# Altium project Lab7-8.PrjPcb
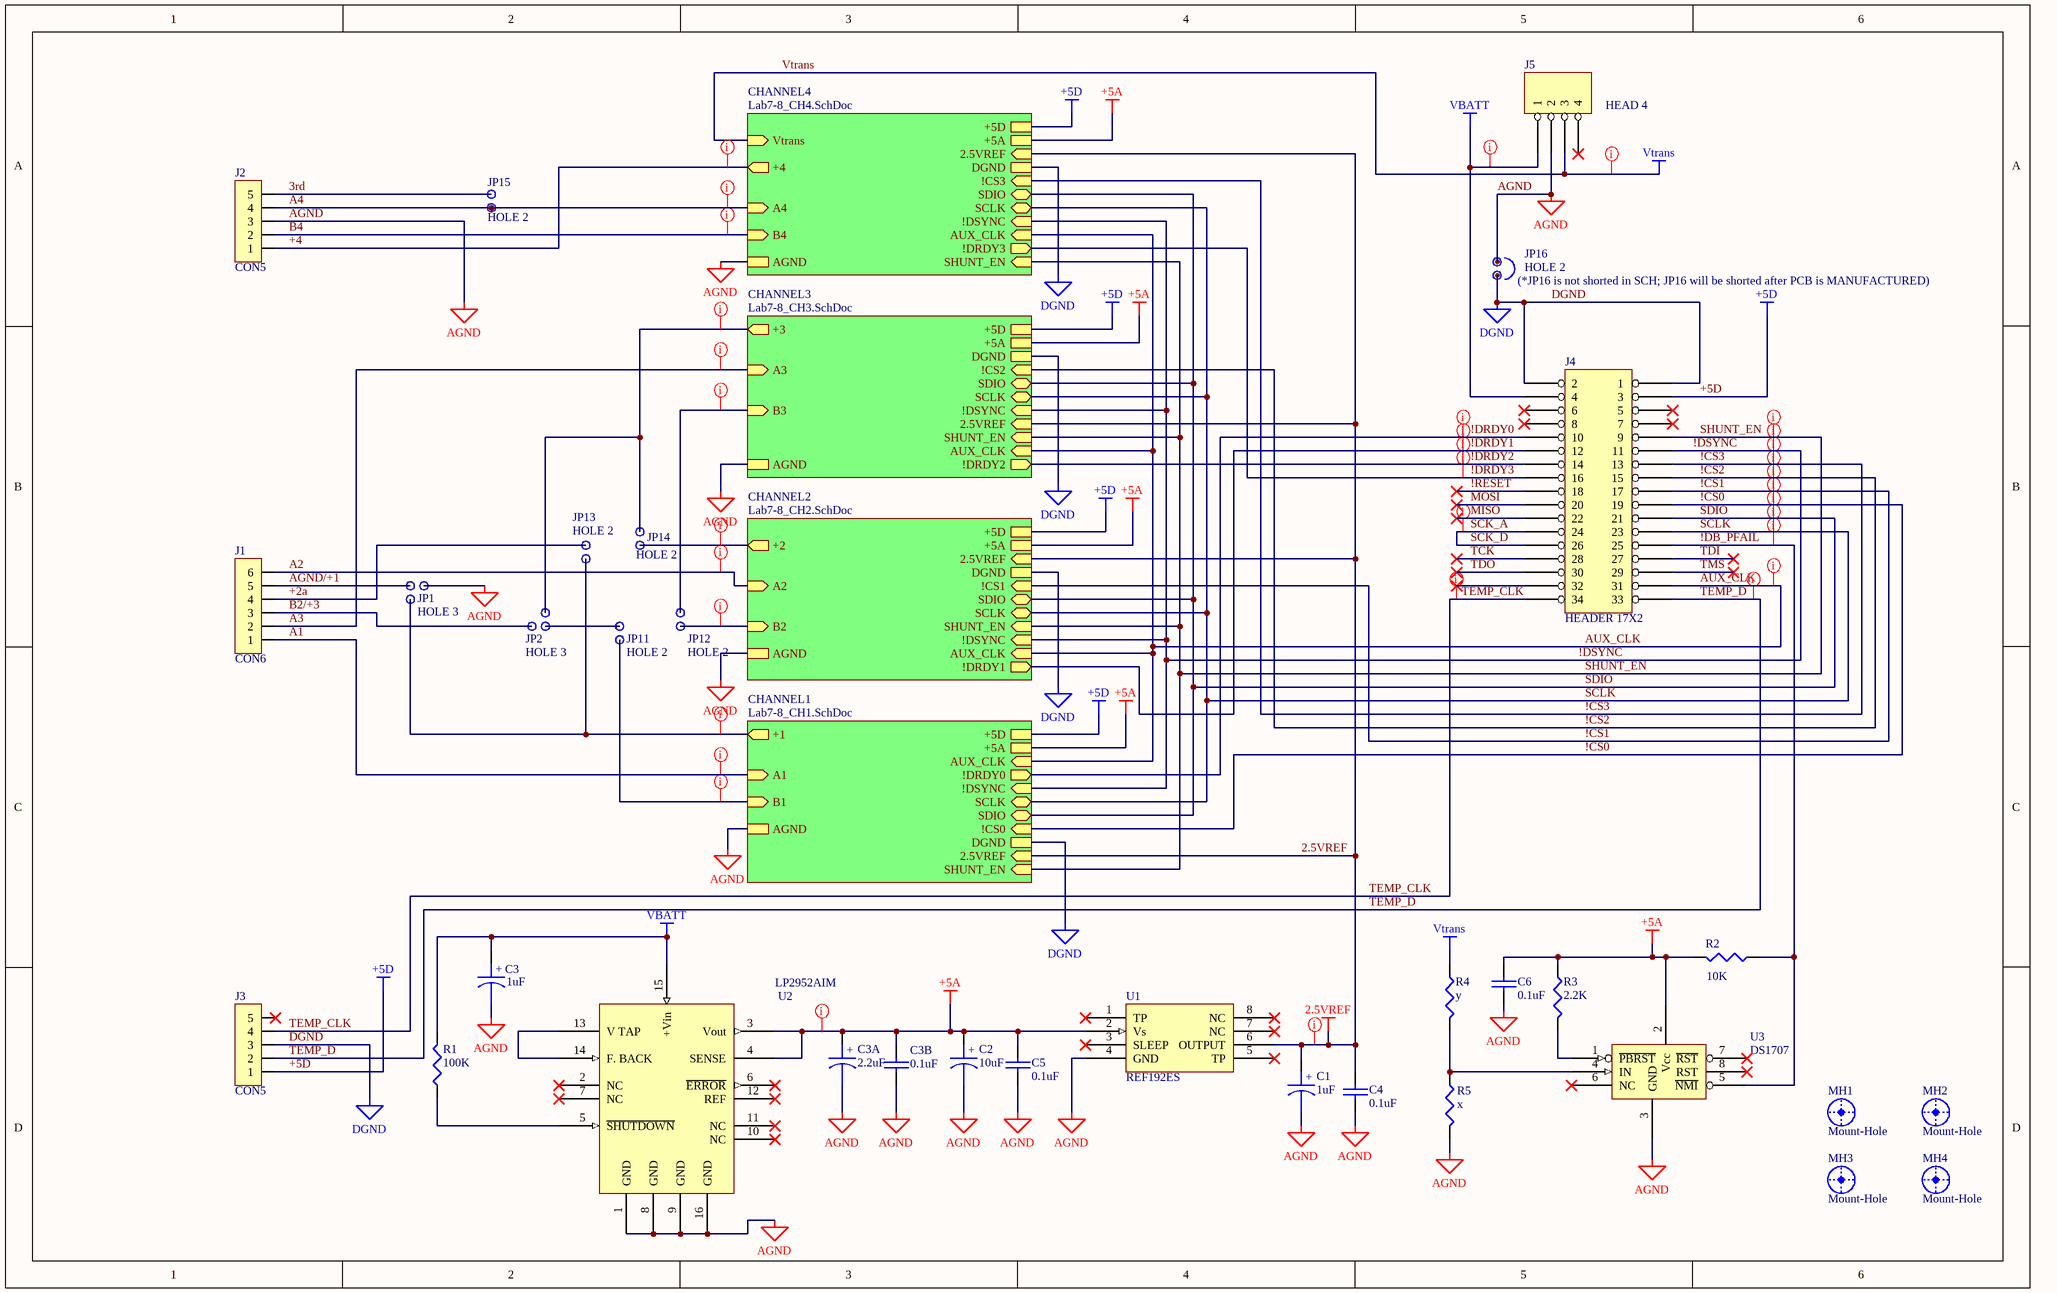
[diagram p0: Lab7-8_TOP.SchDoc]
5 sheets, 121 parts. Net scope: hierarchical (ports join the sheet entries above them; power ports are global).
Board file: Lab9-10.PcbDoc
Sheets:
  Lab7-8_TOP.SchDoc
    CHANNEL1 = Lab7-8_CH1.SchDoc
    CHANNEL2 = Lab7-8_CH2.SchDoc
    CHANNEL3 = Lab7-8_CH3.SchDoc
    CHANNEL4 = Lab7-8_CH4.SchDoc

## Sheet Lab7-8_TOP.SchDoc
size B; DrawnBy: Aaron Huinink; SheetNumber: 1; SheetTotal: 5

### Parts
C1  1uF  [3528]
C2  10uF  [3528]
C3  1uF  [3528]
C3A  2.2uF  [3528]
C3B  0.1uF  [0805]
C4  0.1uF  [0805]
C5  0.1uF  [0805]
C6  0.1uF  [0805]
J1  CON6  [FSFD4.6]
J2  CON5  [FSFD4.5]
J3  CON5  [FSFD4.5]
J4  HEADER 17X2  [HDR2X17]
J5  HEAD 4  [70543-4A]
JP1  HOLE 3  [RAD0.1A]
JP2  HOLE 3  [RAD0.1A]
JP11  HOLE 2  [RAD0.1]
JP12  HOLE 2  [RAD0.1]
JP13  HOLE 2  [RAD0.1]
JP14  HOLE 2  [RAD0.1]
JP15  HOLE 2  [RAD0.1]
JP16  HOLE 2  [RAD0.1]
MH1  Mount-Hole  [screw 4-40]
MH2  Mount-Hole  [screw 4-40]
MH3  Mount-Hole  [screw 4-40]
MH4  Mount-Hole  [screw 4-40]
R1  100K  [0805]
R2  10K  [0805]
R3  2.2K  [0805]
R4  y  [0805]
R5  x  [0805]
U1  REF192ES  [SO-8]
U2  LP2952AIM  [SO-16]
U3  DS1707  [SO-8]

### Sub-sheets
CHANNEL1 = Lab7-8_CH1.SchDoc: +1 (out), A1 (in), B1 (in), AGND, AUX_CLK (in), +5A, +5D, !DSYNC (in), SCLK (bidir), SDIO (bidir), !DRDY0 (out), !CS0 (in), DGND, 2.5VREF (in), SHUNT_EN (in)
CHANNEL2 = Lab7-8_CH2.SchDoc: +2 (out), A2 (in), B2 (in), AGND, AUX_CLK (in), +5A, +5D, SCLK (bidir), SDIO (bidir), !DRDY1 (out), !CS1 (in), DGND, 2.5VREF (in), SHUNT_EN (in), !DSYNC (in)
CHANNEL3 = Lab7-8_CH3.SchDoc: AGND, AUX_CLK (in), +5A, +5D, !DSYNC (in), SCLK (bidir), SDIO (bidir), !DRDY2 (out), !CS2 (in), DGND, 2.5VREF (in), SHUNT_EN (in), +3 (out), A3 (in), B3 (in)
CHANNEL4 = Lab7-8_CH4.SchDoc: AGND, AUX_CLK (in), +5A, +5D, !DSYNC (in), SCLK (bidir), SDIO (bidir), !DRDY3 (out), !CS3 (in), DGND, 2.5VREF (in), SHUNT_EN (in), Vtrans (in), +4 (out), A4 (in), B4 (in)

### Nets
2.5VREF: C1.1 C4.1 U1.6(OUTPUT) ; sheet CHANNEL1/2.5VREF, sheet CHANNEL2/2.5VREF, sheet CHANNEL3/2.5VREF, sheet CHANNEL4/2.5VREF
+5A: C2.1 C3A.1 C3B.1 C5.1 C6.1 R2.2 R3.1 U1.2(Vs) U2.3(Vout) U2.4(SENSE) U3.2(Vcc) ; sheet CHANNEL1/+5A, sheet CHANNEL2/+5A, sheet CHANNEL3/+5A, sheet CHANNEL4/+5A
+5D: J3.1 J4.3 ; sheet CHANNEL1/+5D, sheet CHANNEL2/+5D, sheet CHANNEL3/+5D, sheet CHANNEL4/+5D
AGND: C1.2 C2.2 C3.2 C3A.2 C3B.2 C4.2 C5.2 C6.2 J2.3 J5.2 JP1.3 JP16.2 R5.2 U1.4(GND) U2.1(GND) U2.8(GND) U2.9(GND) U2.16(GND) U3.3(GND) ; sheet CHANNEL1/AGND, sheet CHANNEL2/AGND, sheet CHANNEL3/AGND, sheet CHANNEL4/AGND
DGND: J3.3 J4.1 J4.2 JP16.1 ; sheet CHANNEL1/DGND, sheet CHANNEL2/DGND, sheet CHANNEL3/DGND, sheet CHANNEL4/DGND
VBATT: C3.1 J4.4 J5.1 R1.2 U2.15(+Vin)
Vtrans: J5.3 R4.1 ; sheet CHANNEL4/Vtrans
3rd: J2.5 JP15.2
!CS0: J4.19 ; sheet CHANNEL1/!CS0
!CS1: J4.17 ; sheet CHANNEL2/!CS1
!CS2: J4.15 ; sheet CHANNEL3/!CS2
!CS3: J4.13 ; sheet CHANNEL4/!CS3
!DB_PFAIL: J4.25 R2.1 U3.5(~{NMI})
!DRDY0: J4.10 ; sheet CHANNEL1/!DRDY0
!DRDY1: J4.12 ; sheet CHANNEL2/!DRDY1
!DRDY2: J4.14 ; sheet CHANNEL3/!DRDY2
!DRDY3: J4.16 ; sheet CHANNEL4/!DRDY3
!DSYNC: J4.11 ; sheet CHANNEL1/!DSYNC, sheet CHANNEL2/!DSYNC, sheet CHANNEL3/!DSYNC, sheet CHANNEL4/!DSYNC
!RESET: J4.18
+2a: J1.4 JP13.2
+4: J2.1 ; sheet CHANNEL4/+4
A1: J1.1 ; sheet CHANNEL1/A1
A2: J1.6 ; sheet CHANNEL2/A2
A3: J1.2 ; sheet CHANNEL3/A3
A4: J2.4 JP15.1 ; sheet CHANNEL4/A4
AGND/+1: J1.5 JP1.2
AUX_CLK: J4.31 ; sheet CHANNEL1/AUX_CLK, sheet CHANNEL2/AUX_CLK, sheet CHANNEL3/AUX_CLK, sheet CHANNEL4/AUX_CLK
B2/+3: J1.3 JP2.3
B4: J2.2 ; sheet CHANNEL4/B4
MISO: J4.22
MOSI: J4.20
SCK_A: J4.24 J4.26  [also labelled SCK_D]
SCLK: J4.23 ; sheet CHANNEL1/SCLK, sheet CHANNEL2/SCLK, sheet CHANNEL3/SCLK, sheet CHANNEL4/SCLK
SDIO: J4.21 ; sheet CHANNEL1/SDIO, sheet CHANNEL2/SDIO, sheet CHANNEL3/SDIO, sheet CHANNEL4/SDIO
SHUNT_EN: J4.9 ; sheet CHANNEL1/SHUNT_EN, sheet CHANNEL2/SHUNT_EN, sheet CHANNEL3/SHUNT_EN, sheet CHANNEL4/SHUNT_EN
TCK: J4.28
TDI: J4.27
TDO: J4.30
TEMP_CLK: J3.4 J4.34
TEMP_D: J3.2 J4.33
TMS: J4.29
NetC11_1: JP11.1 ; sheet CHANNEL1/B1
NetC18_1: JP12.1 ; sheet CHANNEL2/B2
NetC24_1: JP12.2 ; sheet CHANNEL3/B3
NetJP1_1: JP1.1 JP13.1 ; sheet CHANNEL1/+1
NetJP2_1: JP2.1 JP14.2 ; sheet CHANNEL3/+3
NetJP2_2: JP2.2 JP11.2
NetJP6_2: JP14.1 ; sheet CHANNEL2/+2
NetR1_1: R1.1 U2.5(~{SHUTDOWN})
NetR3_2: R3.2 U3.1(~{PBRST})
NetR4_2: R4.2 R5.1 U3.4(IN)
NetU2_13: U2.13(V_TAP) U2.14(F._BACK)

Not connected (* = marked no-connect by the designer): J3 5*; J4 5* 6* 7* 8* 32*; J5 4*; U1 1(TP)* 3(SLEEP)* 5(TP)* 7(NC)* 8(NC)*; U2 2(NC)* 6(~{ERROR})* 7(NC)* 10(NC)* 11(NC)* 12(REF)*; U3 6(NC)* 7(~{RST})* 8(RST)*

### Layout directives
net class Digital: !CS0, !CS1, !CS2, !CS3, !DB_PFAIL, !DRDY0, !DRDY1, !DRDY2, !DRDY3, !DSYNC, AUX_CLK, SCK_A, SCLK, SDIO, SHUNT_EN, TEMP_CLK, TEMP_D
net class Power: +4, +5A, NetJP1_1, NetJP2_1, NetJP6_2, VBATT, Vtrans
net class 2.5V_REF: 2.5VREF
net class Analog: A1, A2, A3, A4, B4, NetC11_1, NetC18_1, NetC24_1

### Notes on the sheet
- (near JP16) (*JP16 is not shorted in SCH; JP16 will be shorted after PCB is MANUFACTURED)
- Title
- Size:
- Date:
- A
- Number:
- Time:
- Revision:
- Sheet
- of
- File:
- (in symbol CAPACITOR POL) +

### Library data of the parts
C1-C3 C3A = CAPACITOR POL: Part Field 1: TANT
C3B C4-C6 = CAP
J4 = HEADER 2X17
J5 = HEADER 4
MH1-MH4 = MountHole: Mount hole; LatestRevisionDate: 17-Jul-2002; LatestRevisionNote: Re-released for DXP Platform.; Publisher: Altium Limited
R1-R5 = RES1

## Sheet Lab7-8_CH1.SchDoc
size B; DrawnBy: Aaron Huinink; SheetNumber: 2; SheetTotal: 5
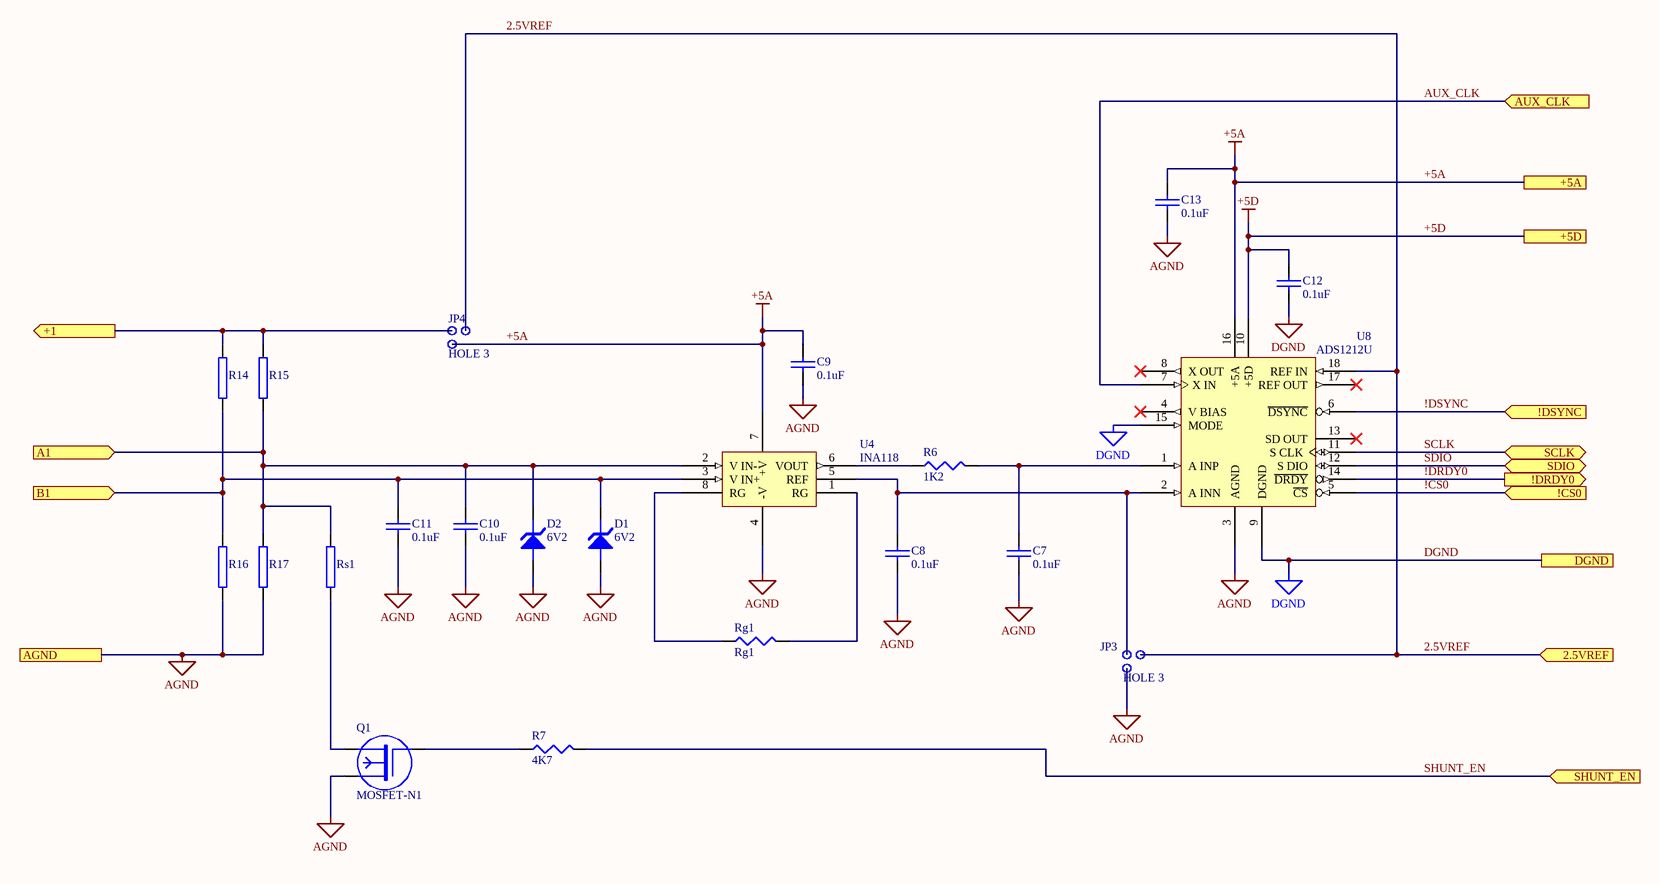
[diagram p1: Lab7-8_CH1.SchDoc]

### Parts
C7  0.1uF  [0805]
C8  0.1uF  [0805]
C9  0.1uF  [0805]
C10  0.1uF  [0805]
C11  0.1uF  [0805]
C12  0.1uF  [0805]
C13  0.1uF  [0805]
D1  6V2  [SOD-123]
D2  6V2  [SOD-123]
JP3  HOLE 3  [RAD0.1A]
JP4  HOLE 3  [RAD0.1A]
Q1  MOSFET-N1  [SOT-23]
R6  1K2  [0805]
R7  4K7  [0805]
R14  bridge R  [bridge resistor]  (value not drawn)
R15  bridge R  [bridge resistor]  (value not drawn)
R16  bridge R  [bridge resistor]  (value not drawn)
R17  bridge R  [bridge resistor]  (value not drawn)
Rg1  Rg1  [0805]
Rs1  bridge R  [bridge resistor]  (value not drawn)
U4  INA118  [SO-8]
U8  ADS1212U  [SOIC18]

### Ports
2.5VREF (in, see Lab7-8_TOP[4C], Lab7-8_CH2[6C], Lab7-8_CH3[6C], Lab7-8_CH4[6C]), !CS0 (in, see Lab7-8_TOP[4C]), !DRDY0 (out, see Lab7-8_TOP[4C]), !DSYNC (in, see Lab7-8_TOP[4C], Lab7-8_CH2[5B], Lab7-8_CH3[6B], Lab7-8_CH4[5B]), +1 (out, see Lab7-8_TOP[3C]), +5A (see Lab7-8_TOP[4C], Lab7-8_CH2[6B], Lab7-8_CH3[6B], Lab7-8_CH4[6B]), +5D (see Lab7-8_TOP[4C], Lab7-8_CH2[6B], Lab7-8_CH3[6B], Lab7-8_CH4[6B]), A1 (in, see Lab7-8_TOP[3C]), AGND (see Lab7-8_TOP[3C], Lab7-8_CH2[1C], Lab7-8_CH3[1C], Lab7-8_CH4[1C]), AUX_CLK (in, see Lab7-8_TOP[4C], Lab7-8_CH2[5A], Lab7-8_CH4[5A]), B1 (in, see Lab7-8_TOP[3C]), DGND (see Lab7-8_TOP[4C], Lab7-8_CH2[6C], Lab7-8_CH3[6C], Lab7-8_CH4[6C]), SCLK (bidir, see Lab7-8_TOP[4C], Lab7-8_CH2[5B], Lab7-8_CH3[6B], Lab7-8_CH4[5B]), SDIO (bidir, see Lab7-8_TOP[4C], Lab7-8_CH2[5B], Lab7-8_CH3[6B], Lab7-8_CH4[5B]), SHUNT_EN (in, see Lab7-8_TOP[4C], Lab7-8_CH2[6C], Lab7-8_CH3[6C], Lab7-8_CH4[6C])

### Nets
2.5VREF: JP3.3 JP4.3 U8.18(REF_IN) ; port 2.5VREF
+5A: C9.1 C13.1 JP4.1 U4.7(+V) U8.16(+5A) ; port +5A  [also labelled +V]
+5D: C12.1 U8.10(+5D) ; port +5D
AGND: C7.2 C8.2 C9.2 C10.2 C11.2 C13.2 D1.A D2.A JP3.1 Q1.2 R16.1 R17.1 U4.4(-V) U8.3(AGND) ; port AGND  [also labelled -V]
DGND: C12.2 U8.9(DGND) U8.15(MODE) ; port DGND
!CS0: U8.5(~{CS}) ; port !CS0
!DRDY0: U8.14(~{DRDY}) ; port !DRDY0
!DSYNC: U8.6(~{DSYNC}) ; port !DSYNC
A1: C10.1 D2.K R15.1 R17.2 Rs1.2 U4.2(V_IN-) ; port A1
AUX_CLK: U8.7(X_IN) ; port AUX_CLK
SCLK: U8.11(S_CLK) ; port SCLK
SDIO: U8.12(S_DIO) ; port SDIO
SHUNT_EN: R7.2 ; port SHUNT_EN
NetC7_1: C7.1 R6.2 U8.1(A_INP)
NetC8_1: C8.1 JP3.2 U4.5(REF) U8.2(A_INN)
NetC11_1: C11.1 D1.K R14.1 R16.2 U4.3(V_IN+) ; port B1
NetJP1_1: JP4.2 R14.2 R15.2 ; port +1
NetQ1_1: Q1.1 R7.1
NetQ1_3: Q1.3 Rs1.1
NetR6_1: R6.1 U4.6(VOUT)
NetRg1_1: Rg1.1 U4.8(RG)
NetRg1_2: Rg1.2 U4.1(RG)

Not connected (* = marked no-connect by the designer): U8 4(V_BIAS)* 8(X_OUT)* 13(SD_OUT)* 17(REF_OUT)*

### Library data of the parts
C7-C13 = CAP
D1 D2 = ZENER3
R6 R7 Rg1 = RES1
R14-R17 Rs1 = RES2
U4 = INA118: Precision, Low Power Instrumentation Amplifier
U8 = ADS1212U(18): 22-Bit Analog-to-Digital Converter

## Sheet Lab7-8_CH2.SchDoc
size B; DrawnBy: Aaron Huinink; SheetNumber: 3; SheetTotal: 5
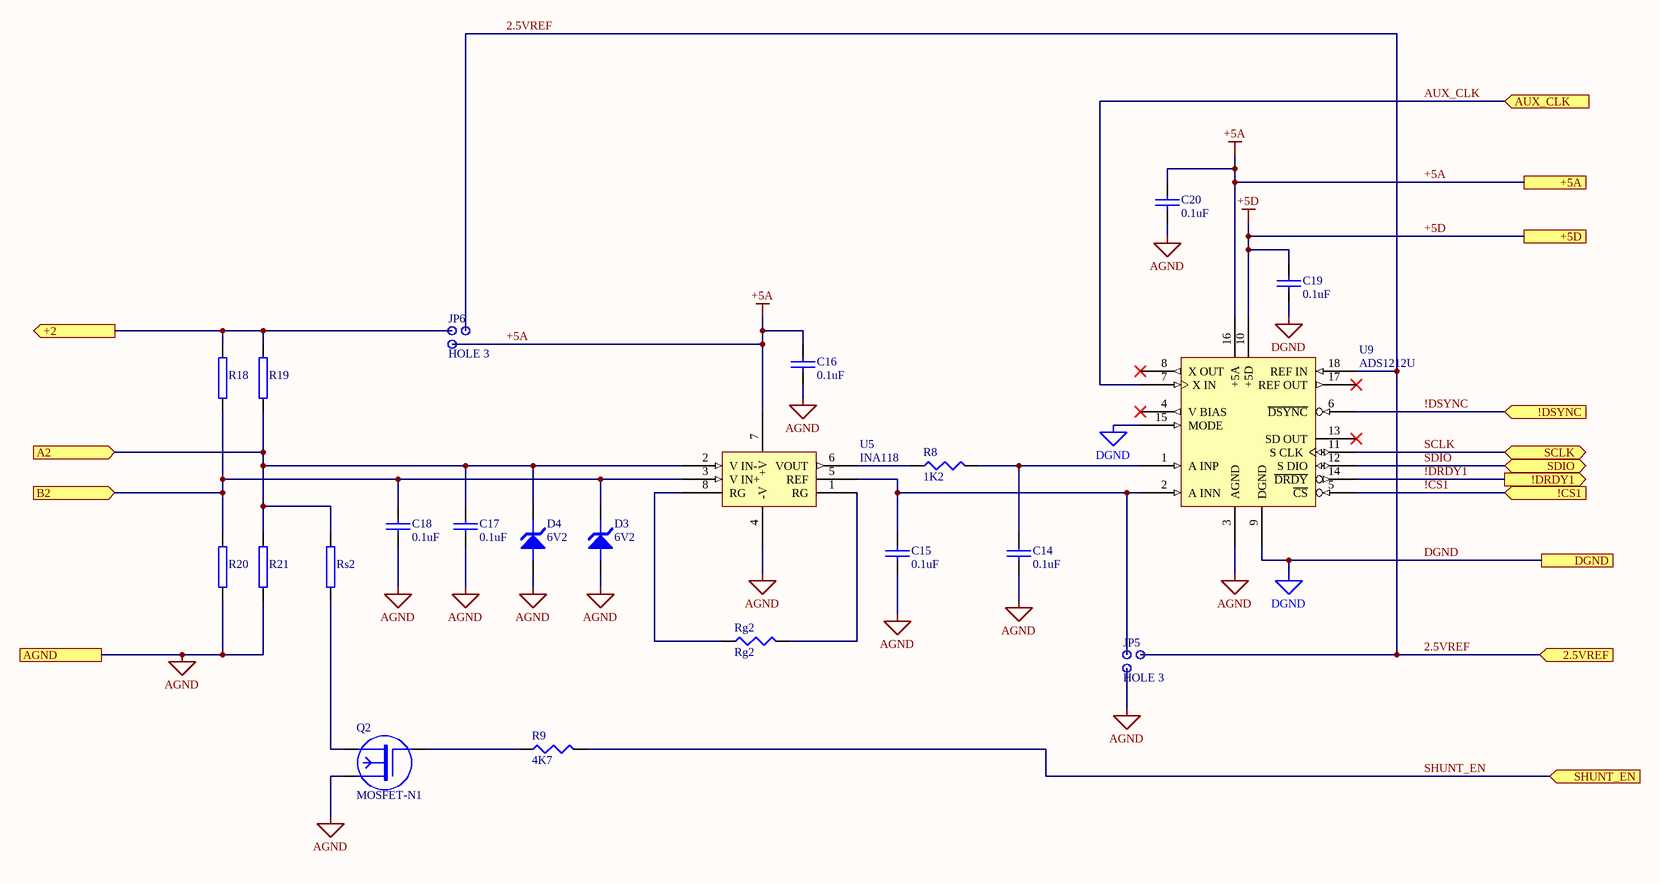
[diagram p2: Lab7-8_CH2.SchDoc]

### Parts
C14  0.1uF  [0805]
C15  0.1uF  [0805]
C16  0.1uF  [0805]
C17  0.1uF  [0805]
C18  0.1uF  [0805]
C19  0.1uF  [0805]
C20  0.1uF  [0805]
D3  6V2  [SOD-123]
D4  6V2  [SOD-123]
JP5  HOLE 3  [RAD0.1A]
JP6  HOLE 3  [RAD0.1A]
Q2  MOSFET-N1  [SOT-23]
R8  1K2  [0805]
R9  4K7  [0805]
R18  bridge R  [bridge resistor]  (value not drawn)
R19  bridge R  [bridge resistor]  (value not drawn)
R20  bridge R  [bridge resistor]  (value not drawn)
R21  bridge R  [bridge resistor]  (value not drawn)
Rg2  Rg2  [0805]
Rs2  bridge R  [bridge resistor]  (value not drawn)
U5  INA118  [SO-8]
U9  ADS1212U  [SOIC18]

### Ports
2.5VREF (in, see Lab7-8_TOP[4B], Lab7-8_CH1[5C], Lab7-8_CH3[6C], Lab7-8_CH4[6C]), !CS1 (in, see Lab7-8_TOP[4B]), !DRDY1 (out, see Lab7-8_TOP[4C]), !DSYNC (in, see Lab7-8_TOP[4B], Lab7-8_CH1[5B], Lab7-8_CH3[6B], Lab7-8_CH4[5B]), +2 (out, see Lab7-8_TOP[3B]), +5A (see Lab7-8_TOP[4B], Lab7-8_CH1[5B], Lab7-8_CH3[6B], Lab7-8_CH4[6B]), +5D (see Lab7-8_TOP[4B], Lab7-8_CH1[5B], Lab7-8_CH3[6B], Lab7-8_CH4[6B]), A2 (in, see Lab7-8_TOP[3B]), AGND (see Lab7-8_TOP[3C], Lab7-8_CH1[1C], Lab7-8_CH3[1C], Lab7-8_CH4[1C]), AUX_CLK (in, see Lab7-8_TOP[4C], Lab7-8_CH1[5A], Lab7-8_CH4[5A]), B2 (in, see Lab7-8_TOP[3B]), DGND (see Lab7-8_TOP[4B], Lab7-8_CH1[5C], Lab7-8_CH3[6C], Lab7-8_CH4[6C]), SCLK (bidir, see Lab7-8_TOP[4B], Lab7-8_CH1[5B], Lab7-8_CH3[6B], Lab7-8_CH4[5B]), SDIO (bidir, see Lab7-8_TOP[4B], Lab7-8_CH1[5B], Lab7-8_CH3[6B], Lab7-8_CH4[5B]), SHUNT_EN (in, see Lab7-8_TOP[4B], Lab7-8_CH1[5C], Lab7-8_CH3[6C], Lab7-8_CH4[6C])

### Nets
2.5VREF: JP5.3 JP6.3 U9.18(REF_IN) ; port 2.5VREF
+5A: C16.1 C20.1 JP6.1 U5.7(+V) U9.16(+5A) ; port +5A  [also labelled +V]
+5D: C19.1 U9.10(+5D) ; port +5D
AGND: C14.2 C15.2 C16.2 C17.2 C18.2 C20.2 D3.A D4.A JP5.1 Q2.2 R20.1 R21.1 U5.4(-V) U9.3(AGND) ; port AGND  [also labelled -V]
DGND: C19.2 U9.9(DGND) U9.15(MODE) ; port DGND
!CS1: U9.5(~{CS}) ; port !CS1
!DRDY1: U9.14(~{DRDY}) ; port !DRDY1
!DSYNC: U9.6(~{DSYNC}) ; port !DSYNC
A2: C17.1 D4.K R19.1 R21.2 Rs2.2 U5.2(V_IN-) ; port A2
AUX_CLK: U9.7(X_IN) ; port AUX_CLK
SCLK: U9.11(S_CLK) ; port SCLK
SDIO: U9.12(S_DIO) ; port SDIO
SHUNT_EN: R9.2 ; port SHUNT_EN
NetC14_1: C14.1 R8.2 U9.1(A_INP)
NetC15_1: C15.1 JP5.2 U5.5(REF) U9.2(A_INN)
NetC18_1: C18.1 D3.K R18.1 R20.2 U5.3(V_IN+) ; port B2
NetJP6_2: JP6.2 R18.2 R19.2 ; port +2
NetQ2_1: Q2.1 R9.1
NetQ2_3: Q2.3 Rs2.1
NetR8_1: R8.1 U5.6(VOUT)
NetRg2_1: Rg2.1 U5.8(RG)
NetRg2_2: Rg2.2 U5.1(RG)

Not connected (* = marked no-connect by the designer): U9 4(V_BIAS)* 8(X_OUT)* 13(SD_OUT)* 17(REF_OUT)*

### Notes on the sheet
- Title
- Size:
- Date:
- A
- Number:
- Time:
- Revision:
- Sheet
- of
- File:

### Library data of the parts
C14-C20 = CAP
D3 D4 = ZENER3
R8 R9 Rg2 = RES1
R18-R21 Rs2 = RES2
U5 = INA118: as U4 on sheet Lab7-8_CH1
U9 = ADS1212U(18): 22-Bit Analog-to-Digital Converter

## Sheet Lab7-8_CH3.SchDoc
size B; DrawnBy: Aaron Huinink; SheetNumber: 4; SheetTotal: 5
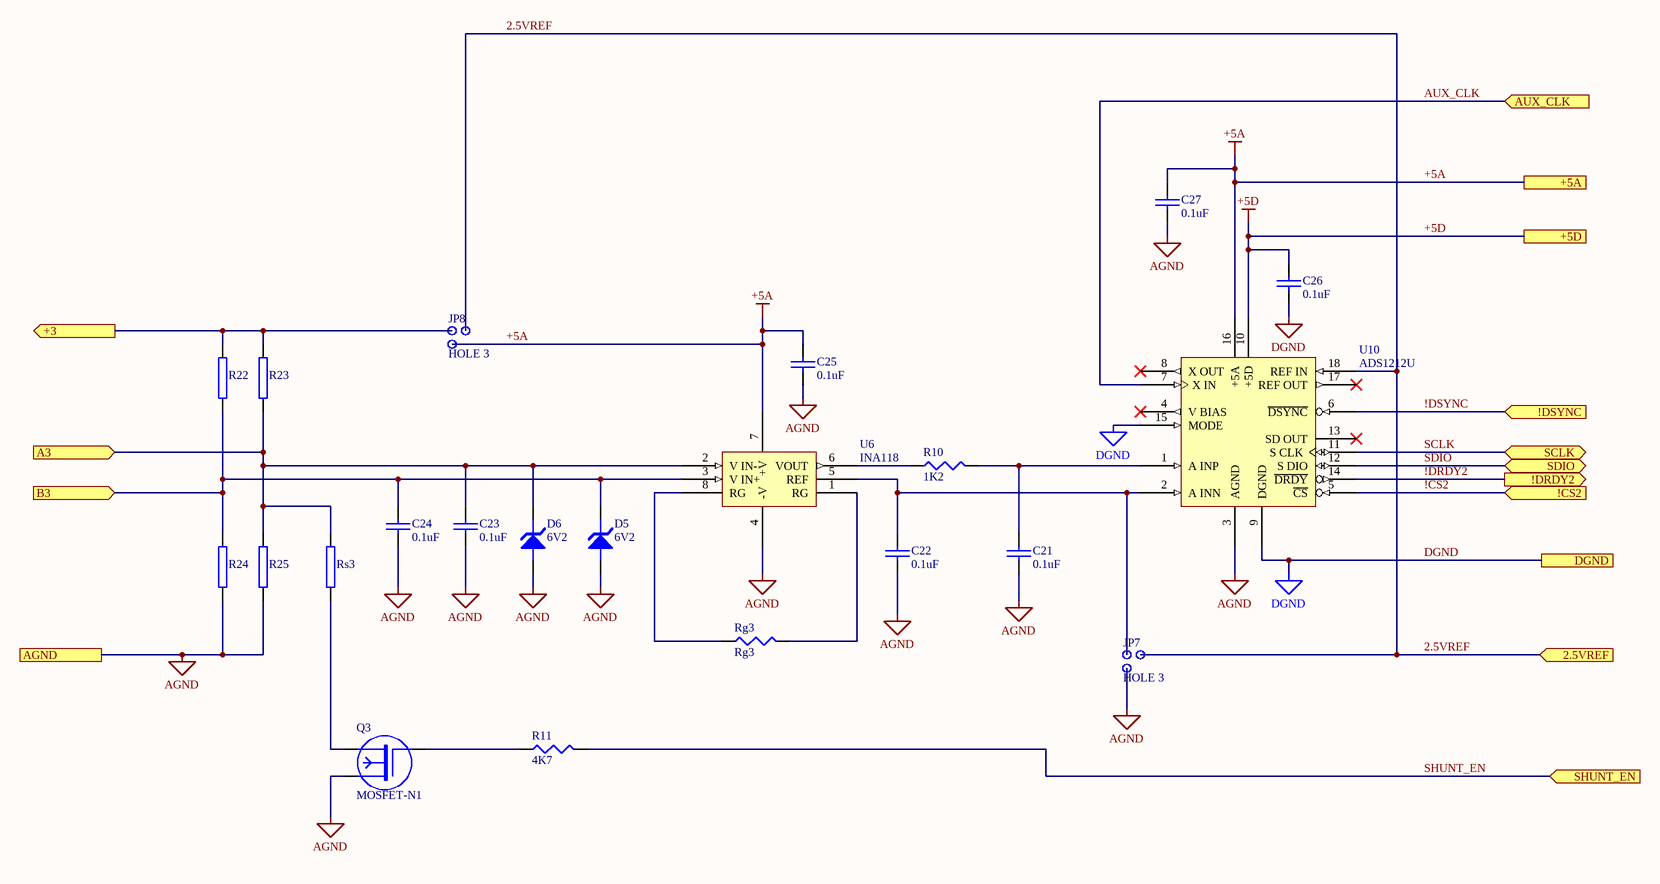
[diagram p3: Lab7-8_CH3.SchDoc]

### Parts
C21  0.1uF  [0805]
C22  0.1uF  [0805]
C23  0.1uF  [0805]
C24  0.1uF  [0805]
C25  0.1uF  [0805]
C26  0.1uF  [0805]
C27  0.1uF  [0805]
D5  6V2  [SOD-123]
D6  6V2  [SOD-123]
JP7  HOLE 3  [RAD0.1A]
JP8  HOLE 3  [RAD0.1A]
Q3  MOSFET-N1  [SOT-23]
R10  1K2  [0805]
R11  4K7  [0805]
R22  bridge R  [bridge resistor]  (value not drawn)
R23  bridge R  [bridge resistor]  (value not drawn)
R24  bridge R  [bridge resistor]  (value not drawn)
R25  bridge R  [bridge resistor]  (value not drawn)
Rg3  Rg3  [0805]
Rs3  bridge R  [bridge resistor]  (value not drawn)
U6  INA118  [SO-8]
U10  ADS1212U  [SOIC18]

### Ports
2.5VREF (in, see Lab7-8_TOP[4B], Lab7-8_CH1[5C], Lab7-8_CH2[6C], Lab7-8_CH4[6C]), !CS2 (in, see Lab7-8_TOP[4B]), !DRDY2 (out, see Lab7-8_TOP[4B]), !DSYNC (in, see Lab7-8_TOP[4B], Lab7-8_CH1[5B], Lab7-8_CH2[5B], Lab7-8_CH4[5B]), +3 (out, see Lab7-8_TOP[3B]), +5A (see Lab7-8_TOP[4B], Lab7-8_CH1[5B], Lab7-8_CH2[6B], Lab7-8_CH4[6B]), +5D (see Lab7-8_TOP[4B], Lab7-8_CH1[5B], Lab7-8_CH2[6B], Lab7-8_CH4[6B]), A3 (in, see Lab7-8_TOP[3B]), AGND (see Lab7-8_TOP[3B], Lab7-8_CH1[1C], Lab7-8_CH2[1C], Lab7-8_CH4[1C]), AUX_CLK (in, see Lab7-8_TOP[4B], Lab7-8_CH1[5A], Lab7-8_CH2[5A], Lab7-8_CH4[5A]), B3 (in, see Lab7-8_TOP[3B]), DGND (see Lab7-8_TOP[4B], Lab7-8_CH1[5C], Lab7-8_CH2[6C], Lab7-8_CH4[6C]), SCLK (bidir, see Lab7-8_TOP[4B], Lab7-8_CH1[5B], Lab7-8_CH2[5B], Lab7-8_CH4[5B]), SDIO (bidir, see Lab7-8_TOP[4B], Lab7-8_CH1[5B], Lab7-8_CH2[5B], Lab7-8_CH4[5B]), SHUNT_EN (in, see Lab7-8_TOP[4B], Lab7-8_CH1[5C], Lab7-8_CH2[6C], Lab7-8_CH4[6C])

### Nets
2.5VREF: JP7.3 JP8.3 U10.18(REF_IN) ; port 2.5VREF
+5A: C25.1 C27.1 JP8.1 U6.7(+V) U10.16(+5A) ; port +5A  [also labelled +V]
+5D: C26.1 U10.10(+5D) ; port +5D
AGND: C21.2 C22.2 C23.2 C24.2 C25.2 C27.2 D5.A D6.A JP7.1 Q3.2 R24.1 R25.1 U6.4(-V) U10.3(AGND) ; port AGND  [also labelled -V]
DGND: C26.2 U10.9(DGND) U10.15(MODE) ; port DGND
!CS2: U10.5(~{CS}) ; port !CS2
!DRDY2: U10.14(~{DRDY}) ; port !DRDY2
!DSYNC: U10.6(~{DSYNC}) ; port !DSYNC
A3: C23.1 D6.K R23.1 R25.2 Rs3.2 U6.2(V_IN-) ; port A3
AUX_CLK: U10.7(X_IN) ; port AUX_CLK
SCLK: U10.11(S_CLK) ; port SCLK
SDIO: U10.12(S_DIO) ; port SDIO
SHUNT_EN: R11.2 ; port SHUNT_EN
NetC21_1: C21.1 R10.2 U10.1(A_INP)
NetC22_1: C22.1 JP7.2 U6.5(REF) U10.2(A_INN)
NetC24_1: C24.1 D5.K R22.1 R24.2 U6.3(V_IN+) ; port B3
NetJP2_1: JP8.2 R22.2 R23.2 ; port +3
NetQ3_1: Q3.1 R11.1
NetQ3_3: Q3.3 Rs3.1
NetR10_1: R10.1 U6.6(VOUT)
NetRg3_1: Rg3.1 U6.8(RG)
NetRg3_2: Rg3.2 U6.1(RG)

Not connected (* = marked no-connect by the designer): U10 4(V_BIAS)* 8(X_OUT)* 13(SD_OUT)* 17(REF_OUT)*

### Notes on the sheet
- Title
- Size:
- Date:
- A
- Number:
- Time:
- Revision:
- Sheet
- of
- File:

### Library data of the parts
C21-C27 = CAP
D5 D6 = ZENER3
R10 R11 Rg3 = RES1
R22-R25 Rs3 = RES2
U6 = INA118: as U4 on sheet Lab7-8_CH1
U10 = ADS1212U(18): 22-Bit Analog-to-Digital Converter

## Sheet Lab7-8_CH4.SchDoc
size B; DrawnBy: Aaron Huinink; SheetNumber: 5; SheetTotal: 5
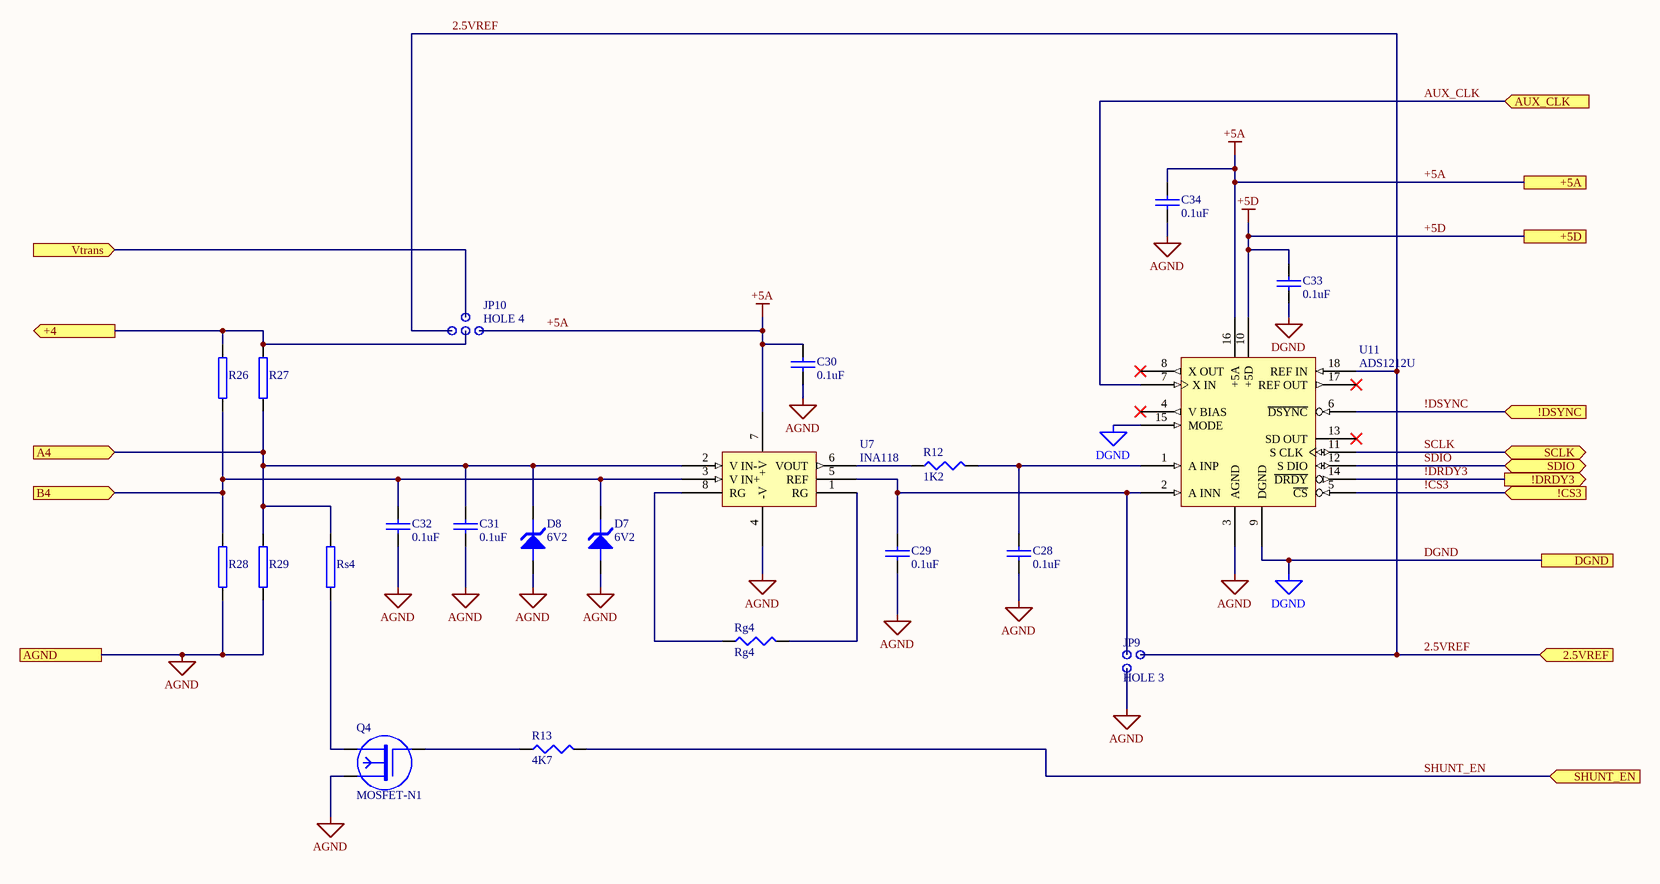
[diagram p4: Lab7-8_CH4.SchDoc]

### Parts
C28  0.1uF  [0805]
C29  0.1uF  [0805]
C30  0.1uF  [0805]
C31  0.1uF  [0805]
C32  0.1uF  [0805]
C33  0.1uF  [0805]
C34  0.1uF  [0805]
D7  6V2  [SOD-123]
D8  6V2  [SOD-123]
JP9  HOLE 3  [RAD0.1A]
JP10  HOLE 4  [RAD0.1B]
Q4  MOSFET-N1  [SOT-23]
R12  1K2  [0805]
R13  4K7  [0805]
R26  bridge R  [bridge resistor]  (value not drawn)
R27  bridge R  [bridge resistor]  (value not drawn)
R28  bridge R  [bridge resistor]  (value not drawn)
R29  bridge R  [bridge resistor]  (value not drawn)
Rg4  Rg4  [0805]
Rs4  bridge R  [bridge resistor]  (value not drawn)
U7  INA118  [SO-8]
U11  ADS1212U  [SOIC18]

### Ports
2.5VREF (in, see Lab7-8_TOP[4A], Lab7-8_CH1[5C], Lab7-8_CH2[6C], Lab7-8_CH3[6C]), !CS3 (in, see Lab7-8_TOP[4A]), !DRDY3 (out, see Lab7-8_TOP[4A]), !DSYNC (in, see Lab7-8_TOP[4A], Lab7-8_CH1[5B], Lab7-8_CH2[5B], Lab7-8_CH3[6B]), +4 (out, see Lab7-8_TOP[3A]), +5A (see Lab7-8_TOP[4A], Lab7-8_CH1[5B], Lab7-8_CH2[6B], Lab7-8_CH3[6B]), +5D (see Lab7-8_TOP[4A], Lab7-8_CH1[5B], Lab7-8_CH2[6B], Lab7-8_CH3[6B]), A4 (in, see Lab7-8_TOP[3A]), AGND (see Lab7-8_TOP[3A], Lab7-8_CH1[1C], Lab7-8_CH2[1C], Lab7-8_CH3[1C]), AUX_CLK (in, see Lab7-8_TOP[4A], Lab7-8_CH1[5A], Lab7-8_CH2[5A], Lab7-8_CH3[6A]), B4 (in, see Lab7-8_TOP[3A]), DGND (see Lab7-8_TOP[4A], Lab7-8_CH1[5C], Lab7-8_CH2[6C], Lab7-8_CH3[6C]), SCLK (bidir, see Lab7-8_TOP[4A], Lab7-8_CH1[5B], Lab7-8_CH2[5B], Lab7-8_CH3[6B]), SDIO (bidir, see Lab7-8_TOP[4A], Lab7-8_CH1[5B], Lab7-8_CH2[5B], Lab7-8_CH3[6B]), SHUNT_EN (in, see Lab7-8_TOP[4A], Lab7-8_CH1[5C], Lab7-8_CH2[6C], Lab7-8_CH3[6C]), Vtrans (in, see Lab7-8_TOP[3A])

### Nets
2.5VREF: JP9.3 JP10.4 U11.18(REF_IN) ; port 2.5VREF
+5A: C30.1 C34.1 JP10.1 U7.7(+V) U11.16(+5A) ; port +5A  [also labelled +V]
+5D: C33.1 U11.10(+5D) ; port +5D
AGND: C28.2 C29.2 C30.2 C31.2 C32.2 C34.2 D7.A D8.A JP9.1 Q4.2 R28.1 R29.1 U7.4(-V) U11.3(AGND) ; port AGND  [also labelled -V]
DGND: C33.2 U11.9(DGND) U11.15(MODE) ; port DGND
Vtrans: JP10.3 ; port Vtrans
!CS3: U11.5(~{CS}) ; port !CS3
!DRDY3: U11.14(~{DRDY}) ; port !DRDY3
!DSYNC: U11.6(~{DSYNC}) ; port !DSYNC
+4: JP10.2 R26.2 R27.2 ; port +4
A4: C31.1 D8.K R27.1 R29.2 Rs4.2 U7.2(V_IN-) ; port A4
AUX_CLK: U11.7(X_IN) ; port AUX_CLK
B4: C32.1 D7.K R26.1 R28.2 U7.3(V_IN+) ; port B4
SCLK: U11.11(S_CLK) ; port SCLK
SDIO: U11.12(S_DIO) ; port SDIO
SHUNT_EN: R13.2 ; port SHUNT_EN
NetC28_1: C28.1 R12.2 U11.1(A_INP)
NetC29_1: C29.1 JP9.2 U7.5(REF) U11.2(A_INN)
NetQ4_1: Q4.1 R13.1
NetQ4_3: Q4.3 Rs4.1
NetR12_1: R12.1 U7.6(VOUT)
NetRg4_1: Rg4.1 U7.8(RG)
NetRg4_2: Rg4.2 U7.1(RG)

Not connected (* = marked no-connect by the designer): U11 4(V_BIAS)* 8(X_OUT)* 13(SD_OUT)* 17(REF_OUT)*

### Notes on the sheet
- Title
- Size:
- Date:
- A
- Number:
- Time:
- Revision:
- Sheet
- of
- File:

### Library data of the parts
C28-C34 = CAP
D7 D8 = ZENER3
R12 R13 Rg4 = RES1
R26-R29 Rs4 = RES2
U7 = INA118: as U4 on sheet Lab7-8_CH1
U11 = ADS1212U(18): 22-Bit Analog-to-Digital Converter

## Nets that join several sheets
2.5VREF: Lab7-8_TOP (C1.1 C4.1 U1.6), Lab7-8_CH1 (JP3.3 JP4.3 U8.18), Lab7-8_CH2 (JP5.3 JP6.3 U9.18), Lab7-8_CH3 (JP7.3 JP8.3 U10.18), Lab7-8_CH4 (JP9.3 JP10.4 U11.18)
+5A: Lab7-8_TOP (11 pins), Lab7-8_CH1 (5 pins), Lab7-8_CH2 (5 pins), Lab7-8_CH3 (5 pins), Lab7-8_CH4 (5 pins)
+5D: Lab7-8_TOP (J3.1 J4.3), Lab7-8_CH1 (C12.1 U8.10), Lab7-8_CH2 (C19.1 U9.10), Lab7-8_CH3 (C26.1 U10.10), Lab7-8_CH4 (C33.1 U11.10)
AGND: Lab7-8_TOP (19 pins), Lab7-8_CH1 (14 pins), Lab7-8_CH2 (14 pins), Lab7-8_CH3 (14 pins), Lab7-8_CH4 (14 pins)
DGND: Lab7-8_TOP (J3.3 J4.1 J4.2 JP16.1), Lab7-8_CH1 (C12.2 U8.9 U8.15), Lab7-8_CH2 (C19.2 U9.9 U9.15), Lab7-8_CH3 (C26.2 U10.9 U10.15), Lab7-8_CH4 (C33.2 U11.9 U11.15)
Vtrans: Lab7-8_TOP (J5.3 R4.1), Lab7-8_CH4 (JP10.3)
!CS0: Lab7-8_TOP (J4.19), Lab7-8_CH1 (U8.5)
!CS1: Lab7-8_TOP (J4.17), Lab7-8_CH2 (U9.5)
!CS2: Lab7-8_TOP (J4.15), Lab7-8_CH3 (U10.5)
!CS3: Lab7-8_TOP (J4.13), Lab7-8_CH4 (U11.5)
!DRDY0: Lab7-8_TOP (J4.10), Lab7-8_CH1 (U8.14)
!DRDY1: Lab7-8_TOP (J4.12), Lab7-8_CH2 (U9.14)
!DRDY2: Lab7-8_TOP (J4.14), Lab7-8_CH3 (U10.14)
!DRDY3: Lab7-8_TOP (J4.16), Lab7-8_CH4 (U11.14)
!DSYNC: Lab7-8_TOP (J4.11), Lab7-8_CH1 (U8.6), Lab7-8_CH2 (U9.6), Lab7-8_CH3 (U10.6), Lab7-8_CH4 (U11.6)
+4: Lab7-8_TOP (J2.1), Lab7-8_CH4 (JP10.2 R26.2 R27.2)
A1: Lab7-8_TOP (J1.1), Lab7-8_CH1 (6 pins)
A2: Lab7-8_TOP (J1.6), Lab7-8_CH2 (6 pins)
A3: Lab7-8_TOP (J1.2), Lab7-8_CH3 (6 pins)
A4: Lab7-8_TOP (J2.4 JP15.1), Lab7-8_CH4 (6 pins)
AUX_CLK: Lab7-8_TOP (J4.31), Lab7-8_CH1 (U8.7), Lab7-8_CH2 (U9.7), Lab7-8_CH3 (U10.7), Lab7-8_CH4 (U11.7)
B4: Lab7-8_TOP (J2.2), Lab7-8_CH4 (5 pins)
NetC11_1: Lab7-8_TOP (JP11.1), Lab7-8_CH1 (5 pins)
NetC18_1: Lab7-8_TOP (JP12.1), Lab7-8_CH2 (5 pins)
NetC24_1: Lab7-8_TOP (JP12.2), Lab7-8_CH3 (5 pins)
NetJP1_1: Lab7-8_TOP (JP1.1 JP13.1), Lab7-8_CH1 (JP4.2 R14.2 R15.2)
NetJP2_1: Lab7-8_TOP (JP2.1 JP14.2), Lab7-8_CH3 (JP8.2 R22.2 R23.2)
NetJP6_2: Lab7-8_TOP (JP14.1), Lab7-8_CH2 (JP6.2 R18.2 R19.2)
SCLK: Lab7-8_TOP (J4.23), Lab7-8_CH1 (U8.11), Lab7-8_CH2 (U9.11), Lab7-8_CH3 (U10.11), Lab7-8_CH4 (U11.11)
SDIO: Lab7-8_TOP (J4.21), Lab7-8_CH1 (U8.12), Lab7-8_CH2 (U9.12), Lab7-8_CH3 (U10.12), Lab7-8_CH4 (U11.12)
SHUNT_EN: Lab7-8_TOP (J4.9), Lab7-8_CH1 (R7.2), Lab7-8_CH2 (R9.2), Lab7-8_CH3 (R11.2), Lab7-8_CH4 (R13.2)